# EAGLE design EasyDriver_v45 (EAGLE 6.5.0)
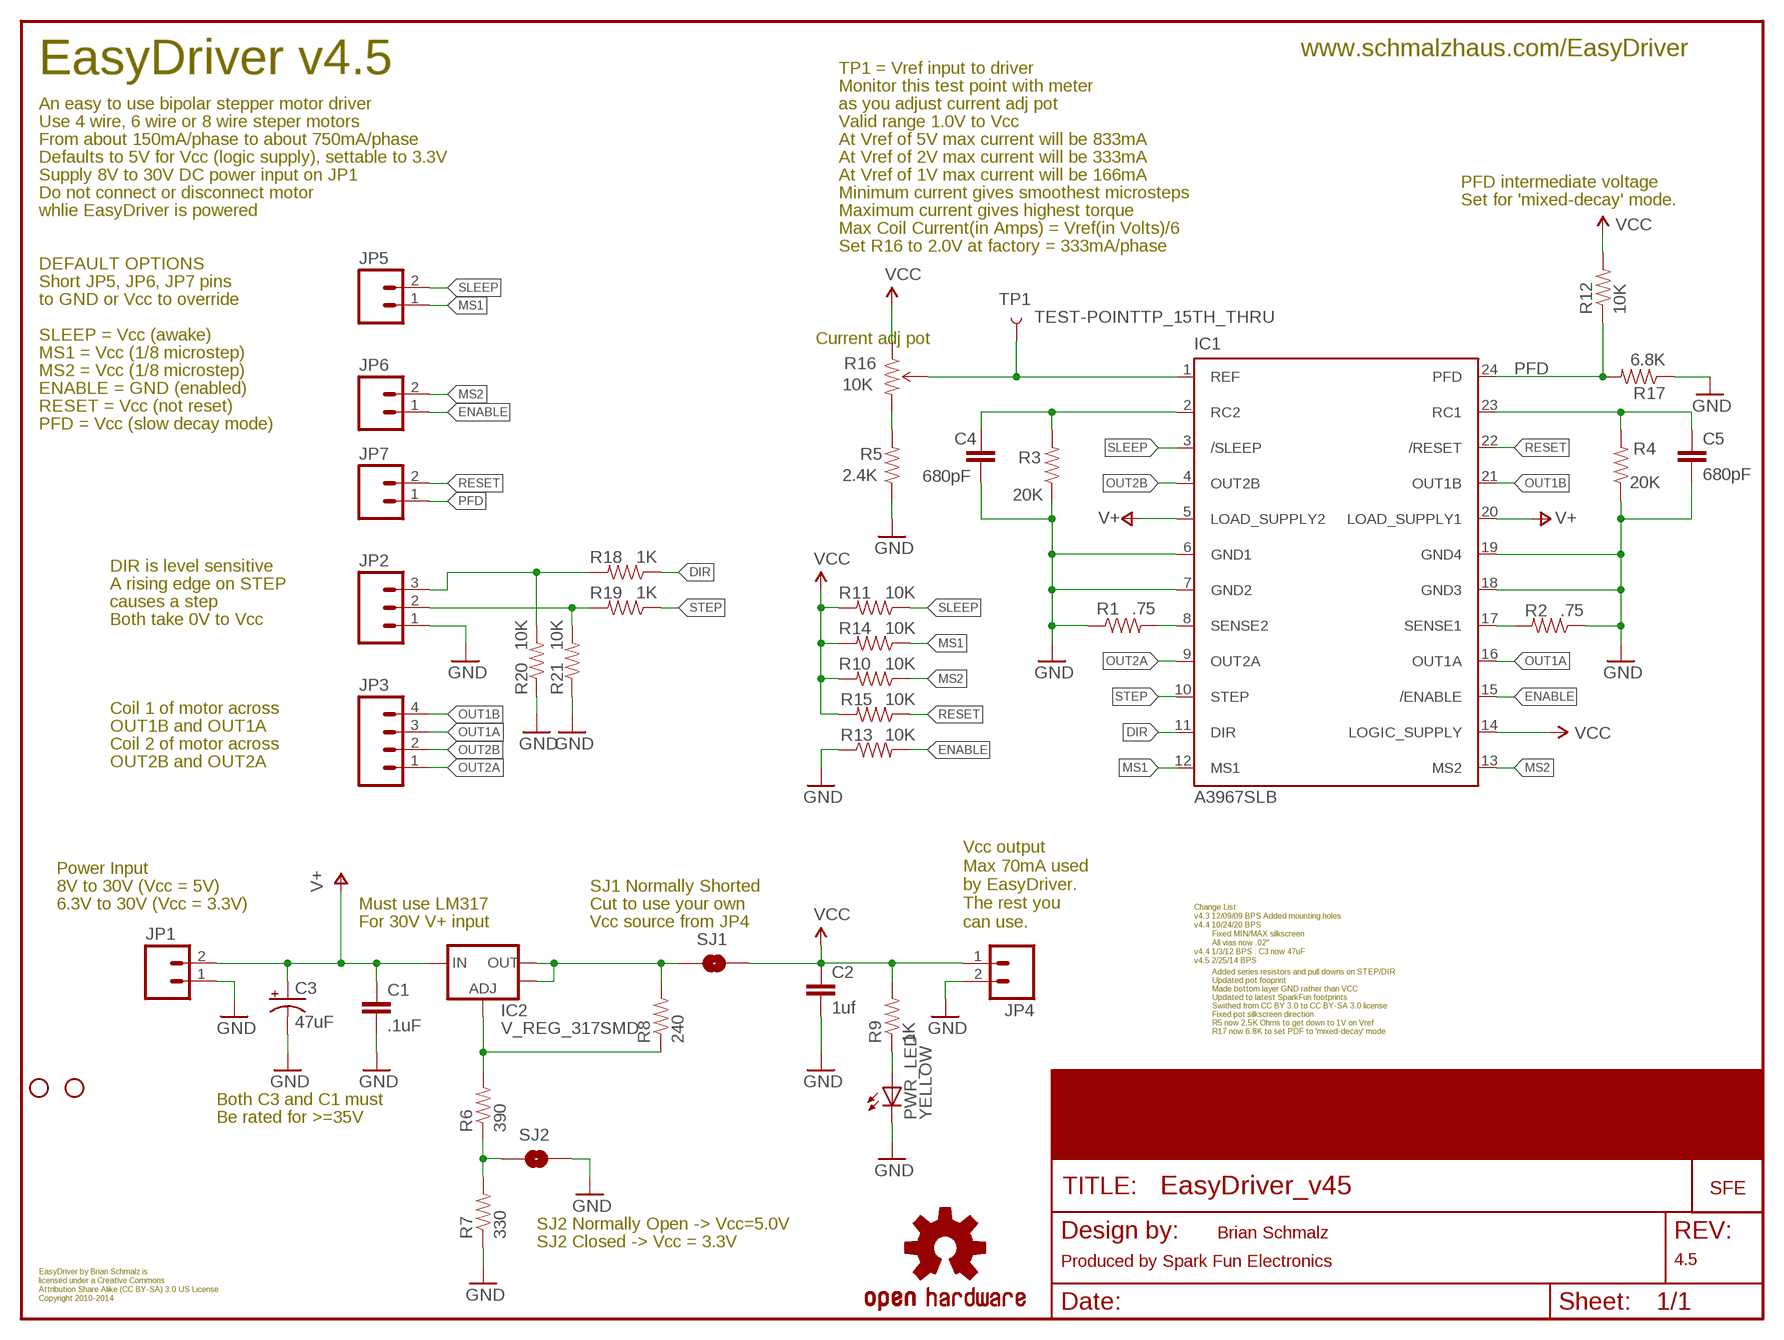
[diagram p0: schematic, sheet 1]

## Parts
C1  .1uF  CAP0603-CAP  [0603-CAP]
C2  1uf  CAP0603-CAP  [0603-CAP]
C3  47uF  CPOL-USD  [PANASONIC_D]
C4  680pF  CAP0603-CAP  [0603-CAP]
C5  680pF  CAP0603-CAP  [0603-CAP]
FRAME2  FRAME-LETTER  [CREATIVE_COMMONS]
IC1  A3967SLB  [SO24W]
IC2  V_REG_317SMD  [SOT223]
JP1  M021X02_NO_SILK  [1X02_NO_SILK]
JP2  M031X03_NO_SILK  [1X03_NO_SILK]
JP3  M041X04_NO_SILK  [1X04_NO_SILK]
JP4  M021X02_NO_SILK  [1X02_NO_SILK]
JP5  M021X02_NO_SILK  [1X02_NO_SILK]
JP6  M021X02_NO_SILK  [1X02_NO_SILK]
JP7  M021X02_NO_SILK  [1X02_NO_SILK]
JP8  STAND-OFF  [STAND-OFF]
JP9  STAND-OFF  [STAND-OFF]
LOGO1  OSHW-LOGOS  [OSHW-LOGO-S]
PWR_LED  YELLOW  LED-YELLOW0603  [LED-0603]
R1  .75  RESISTOR0805-RES  [0805]
R2  .75  RESISTOR0805-RES  [0805]
R3  20K  RESISTOR0603  [0603-RES]
R4  20K  RESISTOR0603  [0603-RES]
R5  2.4K  RESISTOR0603  [0603-RES]
R6  390  RESISTOR0603  [0603-RES]
R7  330  RESISTOR0603  [0603-RES]
R8  240  RESISTOR0603  [0603-RES]
R9  1K  RESISTOR0603  [0603-RES]
R10  10K  RESISTOR0603  [0603-RES]
R11  10K  RESISTOR0603  [0603-RES]
R12  10K  RESISTOR0603  [0603-RES]
R13  10K  RESISTOR0603  [0603-RES]
R14  10K  RESISTOR0603  [0603-RES]
R15  10K  RESISTOR0603  [0603-RES]
R16  10K  TRIMPOT3MM-2  [TRIMPOT-3MM-2]
R17  6.8K  RESISTOR0603  [0603-RES]
R18  1K  RESISTOR0603  [0603-RES]
R19  1K  RESISTOR0603  [0603-RES]
R20  10K  RESISTOR0603  [0603-RES]
R21  10K  RESISTOR0603  [0603-RES]
SJ1  SOLDERJUMPERTRACE  [SJ_2S-TRACE]
SJ2  SOLDERJUMPERNO  [SJ_2S-NO]
TP1  TEST-POINTTP_15TH_THRU  [TP_15TH]
U$2  LOGO-SFENEW  [SFE-NEW-WEBLOGO]

## Nets
5V_ALT: IC2.2(OUT) IC2.4(OUT) R8.2 SJ1.1
DIR: IC1.11(DIR) R18.1
DIR_IN: JP2.3 R18.2 R20.2
ENABLE: IC1.15(/ENABLE) JP6.1 R13.2
GND: C1.2 C2.2 C3.- C4.2 C5.2 IC1.6(GND1) IC1.7(GND2) IC1.18(GND3) IC1.19(GND4) JP1.1 JP2.1 JP4.2 PWR_LED.C R1.1 R2.1 R3.1 R4.1 R5.1 R7.1 R13.1 R17.1 R20.1 R21.1 SJ2.2
MS1: IC1.12(MS1) JP5.1 R14.1
MS2: IC1.13(MS2) JP6.2 R10.1
N$1: IC1.8(SENSE2) R1.2
N$2: PWR_LED.A R9.1
N$3: IC1.17(SENSE1) R2.2
N$4: R6.1 R7.2 SJ2.1
N$5: C4.1 IC1.2(RC2) R3.2
N$6: IC2.1(ADJ) R6.2 R8.1
N$7: C5.1 IC1.23(RC1) R4.2
N$11: R5.2 R16.3(CW)
OUT1A: IC1.16(OUT1A) JP3.3
OUT1B: IC1.21(OUT1B) JP3.4
OUT2A: IC1.9(OUT2A) JP3.1
OUT2B: IC1.4(OUT2B) JP3.2
PFD: IC1.24(PFD) JP7.1 R12.1 R17.2
RESET: IC1.22(/RESET) JP7.2 R15.1
SLEEP: IC1.3(/SLEEP) JP5.2 R11.1
STEP: IC1.10(STEP) R19.1
STEP_IN: JP2.2 R19.2 R21.2
V+: C1.1 C3.+ IC1.5(LOAD_SUPPLY2) IC1.20(LOAD_SUPPLY1) IC2.3(IN) JP1.2
VCC: C2.1 IC1.14(LOGIC_SUPPLY) JP4.1 R9.2 R10.2 R11.2 R12.2 R14.2 R15.2 R16.1(CCW) SJ1.2
VREF: IC1.1(REF) R16.2(WIPER) TP1.P$1

## Notes on the sheet
- www.schmalzhaus.com/EasyDriver
- EasyDriver v4.5 | TP1 = Vref input to driver
- Monitor this test point with meter
- An easy to use bipolar stepper motor driver | as you adjust current adj pot
- Use 4 wire, 6 wire or 8 wire steper motors | Valid range 1.0V to Vcc
- From about 150mA/phase to about 750mA/phase | At Vref of 5V max current will be 833mA
- Defaults to 5V for Vcc (logic supply), settable to 3.3V | At Vref of 2V max current will be 333mA
- Supply 8V to 30V DC power input on JP1 | At Vref of 1V max current will be 166mA
- PFD intermediate voltage
- Do not connect or disconnect motor | Minimum current gives smoothest microsteps
- Set for 'mixed-decay' mode.
- whlie EasyDriver is powered | Maximum current gives highest torque
- Max Coil Current(in Amps) = Vref(in Volts)/6
- Set R16 to 2.0V at factory = 333mA/phase
- DEFAULT OPTIONS
- Short JP5, JP6, JP7 pins
- to GND or Vcc to override
- SLEEP = Vcc (awake) | Current adj pot
- MS1 = Vcc (1/8 microstep)
- MS2 = Vcc (1/8 microstep)
- ENABLE = GND (enabled)
- RESET = Vcc (not reset)
- PFD = Vcc (slow decay mode)
- DIR is level sensitive
- A rising edge on STEP
- causes a step
- Both take 0V to Vcc
- Coil 1 of motor across
- OUT1B and OUT1A
- Coil 2 of motor across
- OUT2B and OUT2A
- Power Input
- 8V to 30V (Vcc = 5V) | SJ1 Normally Shorted
- 6.3V to 30V (Vcc = 3.3V) | Must use LM317 | Cut to use your own | Change List:
- v4.3 12/09/09 BPS Added mounting holes
- For 30V V+ input | Vcc source from JP4
- Vcc output
  Max 70mA used 
  by EasyDriver.
  The rest you 
  can use.
- v4.4 10/24/20 BPS
- Fixed MIN/MAX silkscreen
- All vias now .02"
- v4.4 1/3/12 BPS : C3 now 47uF
- v4.5 2/25/14 BPS
- Added series resistors and pull downs on STEP/DIR
  Updated pot fooprint
  Made bottom layer GND rather than VCC
  Updated to latest SparkFun footprints
  Swithed from CC BY 3.0 to CC BY-SA 3.0 license
  Fixed pot silkscreen direction
  R5 now 2.5K Ohms to get down to 1V on Vref
  R17 now 6.8K to set PDF to 'mixed-decay' mode
- Both C3 and C1 must
- Be rated for >=35V
- SJ2 Normally Open -> Vcc=5.0V
- Brian Schmalz
- SJ2 Closed -> Vcc = 3.3V
- Produced by Spark Fun Electronics | 4.5
- EasyDriver by Brian Schmalz is
- licensed under a Creative Commons
- Attribution Share Alike (CC BY-SA) 3.0 US License
- Copyright 2010-2014

## Library data of the parts
C1 C2 C4 C5 = SparkFun-Capacitors:CAP: Capacitor Standard 0603 ceramic capacitor, and 0.1" leaded capacitor.
C3 = rcl:CPOL-US: POLARIZED CAPACITOR, American symbol
FRAME2 = SparkFun-Aesthetics:FRAME-LETTER: Schematic Frame Standard 8.5x11 US Letter frame
IC1 = Allegro:A3967SLB: ANALOG DEVICES
IC2 = SparkFun03_30_09:V_REG_317: Voltage Regulator Standard LM317 adjustable voltage regulator. AOI (Adjust Output Input). Google 'LM317 Calculator' for easy to use app to get the two resistor values needed. 240/720 for 5V output. 240/390 for 3.3V output. Spark Fun Electronics SKU : COM-00527
JP1 JP4-JP7 = SparkFun:M02: Header 2 Standard 2-pin 0.1" header. Use with straight break away headers (SKU : PRT-00116), right angle break away headers (PRT-00553), swiss pins (PRT-00743), machine pins (PRT-00117), and female headers (PRT-00115). Molex polarized connector foot print use with SKU : PRT-08233 with associated crimp pins and housings.
JP2 = SparkFun:M03: Header 3 Standard 3-pin 0.1" header. Use with straight break away headers (SKU : PRT-00116), right angle break away headers (PRT-00553), swiss pins (PRT-00743), machine pins (PRT-00117), and female headers (PRT-00115). Molex polarized connector foot print use with SKU : PRT-08232 with associated crimp pins and housings.
JP3 = SparkFun:M04: Header 4 Standard 4-pin 0.1" header. Use with straight break away headers (SKU : PRT-00116), right angle break away headers (PRT-00553), swiss pins (PRT-00743), machine pins (PRT-00117), and female headers (PRT-00115). Molex polarized connector foot print use with SKU : PRT-08231 with associated crimp pins and housings.
JP8 JP9 = SparkFun-7-28-09:STAND-OFF: Stand Off This is the mechanical footprint for a #4 phillips button head screw. Use the keepout ring to avoid running the screw head into surrounding components. SKU : PRT-00447
LOGO1 = SparkFun-Aesthetics:OSHW-LOGO: Open Source Hardware Logo This logo indicates the piece of hardware it is found on incorporates a OSHW license and/or adheres to the definition of open source hardware found here: http://freedomdefined.org/OSHW
PWR_LED = SparkFun-LED:LED-YELLOW: Yellow SMD LEDs LilyPad 1206- DIO-09909 0603- DIO-09003; PROD_ID: DIO-09003
R1-R15 R17-R21 = SparkFun-Resistors:RESISTOR: Resistor Basic schematic elements and footprints for 0603, 1206, and PTH resistors.
R16 = SparkFun-Electromechanical:TRIMPOT: Various small potentiometers for "set-and-forget" applications
SJ1 SJ2 = SparkFun03_30_09:SOLDERJUMPER: Solder Jumper Standard SMD solder jumper. Used to automate production. Two varients : Normally Open and Normally Closed are the same, but have different paste layers. NC will have a large amount of paste and should jumper during reflow.
TP1 = SparkFun-Passives:TEST-POINT: Bare copper test points for troubleshooting or ICT
U$2 = SparkFun:LOGO-SFE: Spark Fun Electronics PCB Logo This is the standard Spark Fun Electronics PCB logo.

## Board
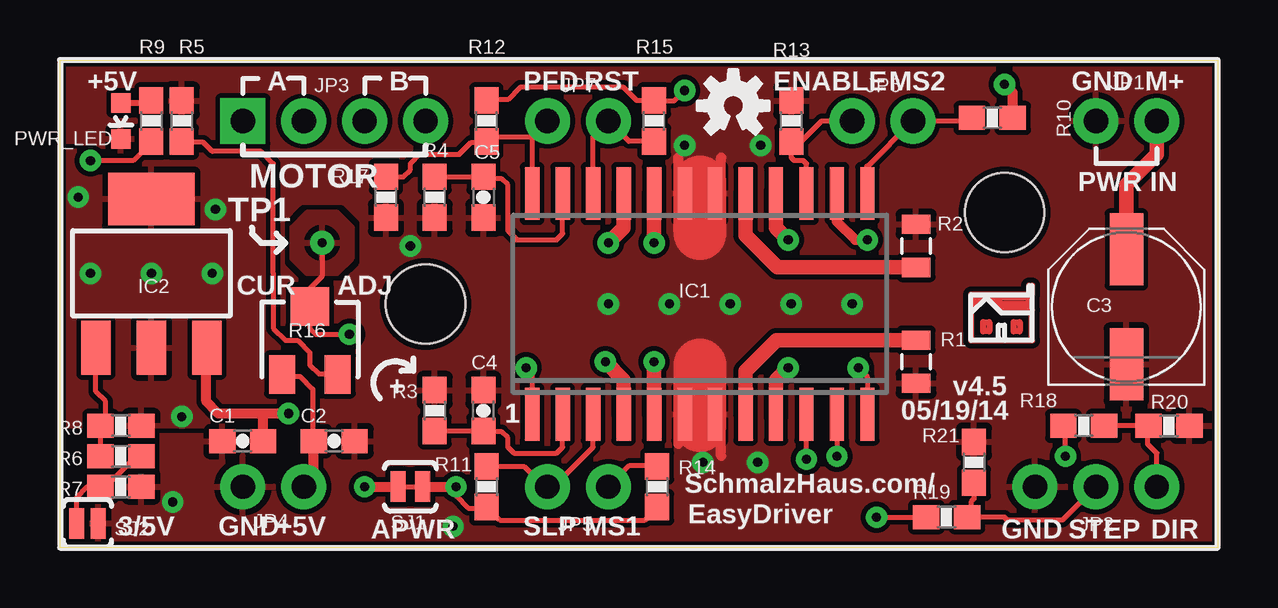
[diagram p1: board, top side]
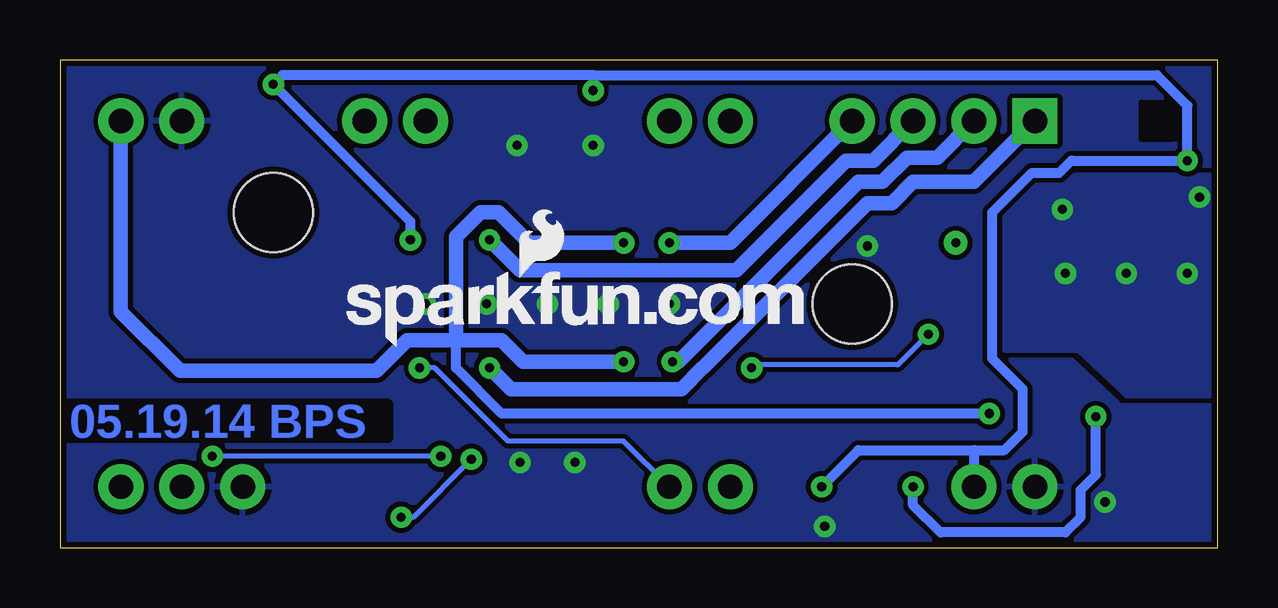
[diagram p2: board, bottom side, seen from below]

Size 48.26 x 20.32 mm. Coordinates in mm from the lower left corner, seen from the top.
Outline: 0,0 0,20.32 48.26,20.32 48.26,0 0,0
Copper layers (1*16): Top 0.035mm / dielectric 1.5mm / Bottom 0.035mm
Design rules "GoldPhoenix_8and8": minimum track width 7mil, minimum drill 15mil, track to track 8mil, track to pad 8mil, pad to pad 8mil, via to via 8mil, smd to smd 8mil, copper to edge 10mil, drill to drill 8mil, minimum pad ring 12mil, minimum via ring 10mil, stop-mask expansion 4mil, vias tented up to drill 25mil, thermal gap 10mil
bRestrict: area 1.9,17 to 3.2,18.5

### Footprints (pad centres in the part's own frame; a part is rotated, then mirrored left to right if it is on the bottom)
0603-CAP = smd 1.1 x 1: 1 -0.85,0; 2 0.85,0
PANASONIC_D = smd 3 x 1.4: + 2.4,0; - -2.4,0
SO24W = smd 0.6 x 2.2: 1 -6.985,-4.6; 2 -5.715,-4.6; 3 -4.445,-4.6; 4 -3.175,-4.6; 5 -1.905,-4.6; 6 -0.635,-4.6; 7 0.635,-4.6; 8 1.905,-4.6; 9 3.175,-4.6; 10 4.445,-4.6; 11 5.715,-4.6; 12 6.985,-4.6; 13 6.985,4.6; 14 5.715,4.6; 15 4.445,4.6; 16 3.175,4.6; 17 1.905,4.6; 18 0.635,4.6; 19 -0.635,4.6; 20 -1.905,4.6; 21 -3.175,4.6; 22 -4.445,4.6; 23 -5.715,4.6; 24 -6.985,4.6
SOT223 = smd 1.219 x 2.235: 1 -2.311,-3.099; 2 0,-3.099; 3 2.311,-3.099 | smd 3.6 x 2.2: 4 0,3.099
1X02_NO_SILK = drill 1.016 pad 1.88: 1 0,0; 2 2.54,0
1X03_NO_SILK = drill 1.016 pad 1.88: 1 0,0; 2 2.54,0; 3 5.08,0
1X04_NO_SILK = drill 1.016 pad 1.88 square: 1 0,0 | drill 1.016 pad 1.88: 2 2.54,0; 3 5.08,0; 4 7.62,0
STAND-OFF = hole 3.302: 0,0
LED-0603 = smd 0.8 x 0.8: A 0,-0.75; C 0,0.75
0805 = smd 0.8 x 1.2: 1 -0.9,0; 2 0.9,0
0603-RES = smd 1.1 x 1: 1 -0.85,0; 2 0.85,0
TRIMPOT-3MM-2 = smd 1.092 x 1.6: 1 -1.155,-1.421; 3 1.155,-1.421 | smd 1.6 x 1.6: 2 0,1.421
SJ_2S-TRACE = smd 0.635 x 1.27: 1 -0.508,0; 2 0.508,0
SJ_2S-NO = smd 0.635 x 1.27: 1 -0.45,0; 2 0.45,0
TP_15TH = drill 0.381 pad 0.61: P$1 0,0

### Placement (x,y rotation side)
C1  7.62,4.45 180 top
C2  11.43,4.45 0 top
C3  44.45,10.03 90 top
C4  17.65,5.71 90 top
C5  17.65,14.61 270 top
FRAME2  17.78,-10.16 0 top  (outside the outline)
IC1  26.67,10.16 0 top
IC2  3.81,11.43 0 top
JP1  43.18,17.78 0 top
JP2  40.64,2.54 0 top
JP3  7.62,17.78 0 top
JP4  10.16,2.54 180 top
JP5  22.86,2.54 180 top
JP6  33.02,17.78 0 top
JP7  20.32,17.78 0 top
JP8  39.37,13.97 0 top
JP9  15.24,10.16 0 top
LOGO1  28.07,18.41 0 top
PWR_LED  2.54,17.78 180 top
R1  35.69,7.75 90 top
R2  35.69,12.57 270 top
R3  15.62,5.71 270 top
R4  15.62,14.61 90 top
R5  5.08,17.78 270 top
R6  2.54,3.81 180 top
R7  2.54,2.54 180 top
R8  2.54,5.08 0 top
R9  3.81,17.78 270 top
R10  38.86,17.91 0 top
R11  17.78,2.54 270 top
R12  17.78,17.78 90 top
R13  30.48,17.78 270 top
R14  24.89,2.54 270 top
R15  24.77,17.78 90 top
R16  10.41,8.64 0 top
R17  13.59,14.61 90 top
R18  42.67,5.08 0 top
R19  36.96,1.27 0 top
R20  46.23,5.08 180 top
R21  38.1,3.56 270 top
SJ1  14.61,2.54 0 top
SJ2  1.14,1.02 0 top
TP1  10.92,12.7 0 top
U$1  [SCHMALZHAUS_SMALL]  39.24,8.64 0 top
U$2  36.32,8.38 0 bottom

### Tracks (layer width: path | path; a pad name or v marks a point on that pad's centre or on a via)
5V_ALT  (via drill 0.38)
  Top 0.254: R8.2 3.81,5.08
  Top 0.406: v12.7,2.54 SJ1.1
  Bottom 0.406: v5.08,5.46 5.08,3.05 5.71,2.41 5.71,1.27 6.35,0.64 11.56,0.64 12.7,1.78 v12.7,2.54
  other vias: 1.27,11.43 3.81,11.43 6.35,11.43 6.48,14.1 0.76,14.61
  pour Top (rank 2): 0,5.08 0,16.51 10.16,16.51 10.16,5.08
  pour Bottom (rank 2): 0,15.49 7.49,15.49 8.89,13.97 8.89,8.26 5.84,8.26 3.81,6.35 0,6.35
DIR  (via drill 0.38)
  Top 0.203: IC1.11 v32.38,3.81 | v41.91,3.81 41.91,4.99 R18.1
  Bottom 0.203: v32.38,3.81 v41.91,3.81
DIR_IN
  Top 0.203: JP2.3 45.72,3.94 45.34,4.32 45.34,5.04 R20.2 R18.2
ENABLE
  Top 0.203: IC1.15 31.11,16 30.99,16.13 30.61,16.13 30.48,16.26 R13.2 30.9,16.93 31.75,17.78 JP6.1
GND  (via drill 0.38)
  Top 0.203: 25.78,6.99 26.29,6.99 26.67,7.37
  Top 0.406: 27.56,3.81 27.56,7.24 | 27.56,13.21 27.56,16.26 | 25.78,13.21 25.78,16.26 | 25.78,4.32 25.78,6.99
  Top 2.184: 26.67,13.08 26.67,15.24 | 26.67,5.08 26.67,7.37 26.67,7.62
  other vias: 25.4,10.16 27.94,10.16 22.86,10.16 30.48,10.16 33.02,10.16 4.7,1.91 14.61,12.57 16.38,0.89 26.8,3.56 29.08,3.56 26.04,16.76 29.21,16.76
  pour Top (rank 3): 0,0 0,5.08 0,20.32 48.26,20.32 48.26,0
  pour Bottom (rank 3): 15.24,17.78 17.65,15.24 17.78,15.37 17.65,15.37
  pour Bottom (rank 4): 0,0 0,20.32 48.26,20.32 48.26,0
MS1  (via drill 0.38)
  Top 0.203: IC1.12 33.66,7.11 v33.27,7.49 | 23.51,3.19 JP5.1 23.75,3.43 24.85,3.43 R14.1
  Bottom 0.203: v33.27,7.49 32.64,7.49 29.59,4.45 24.77,4.45 JP5.1
MS2
  Top 0.203: 33.66,15.88 JP6.2 37.88,17.78 R10.1
  Top 0.254: IC1.13 33.66,15.88
N$1
  Top 0.406: 35.31,8.64 35.69,8.64 R1.2
  Top 0.61: IC1.8 28.57,7.34 29.87,8.64 35.31,8.64
N$2
  Top 0.254: PWR_LED.A 3.81,18.53 R9.1
N$3
  Top 0.406: 35.31,11.68 35.69,11.68 R2.2
  Top 0.61: IC1.17 28.57,13.02 29.91,11.68 35.31,11.68
N$4
  Top 0.203: SJ2.1 0.69,2.09 1.14,2.54 R7.2 1.91,2.54 2.92,3.56 3.14,3.56 R6.1
N$5
  Top 0.203: R3.2 C4.1 17.69,4.83 18.41,4.83 18.67,4.57 18.67,4.19 18.92,3.94 20.7,3.94 20.95,4.19 IC1.2
N$6
  Top 0.203: R6.2 R8.1 | 1.91,5.08 1.91,6.1 1.5,6.5 IC2.1
  Top 0.406: 1.27,8.1 1.5,8.1 IC2.1 | R8.1 1.91,5.08
N$7
  Top 0.203: IC1.23 20.95,13.08 20.7,12.83 19.05,12.83 18.67,13.21 18.67,15.11 18.41,15.37 17.74,15.37 C5.1 R4.2
N$11
  Top 0.203: R5.2 5.12,16.89 5.97,16.89 6.35,16.51 8.38,16.51 8.89,16 8.89,11.43 8.89,9.14 9.4,8.64 9.91,8.64 10.41,8.13 10.41,7.62 10.79,7.24 11.54,7.24 R16.3
OUT1A  (via drill 0.38)
  Top 0.406: IC1.16 29.94,14.76
  Top 0.61: 29.84,14.86 IC1.16 29.84,13.34 v30.35,12.83
  Bottom 0.61: v30.35,12.83 29.08,11.56 20.07,11.56 15.49,16.13 14.35,16.13 JP3.3
OUT1B  (via drill 0.38)
  Top 0.61: v22.86,12.7 23.5,13.34 IC1.21
  Bottom 0.61: v22.86,12.7 20.32,12.7 JP3.4
OUT2A  (via drill 0.38)
  Top 0.406: IC1.9 29.75,5.56
  Top 0.61: 29.84,5.46 IC1.9 29.84,6.99 v30.35,7.49
  Bottom 0.406: 21.46,7.49 21.47,7.49
  Bottom 0.61: 21.46,7.49 14.61,14.35 13.59,14.35 12.7,15.24 10.16,15.24 JP3.1 | v30.35,7.49 29.46,6.6 22.36,6.6 21.47,7.49
OUT2B  (via drill 0.38)
  Top 0.61: v22.73,7.75 23.5,6.99 IC1.4
  Bottom 0.61: JP3.2 11.68,16.26 12.95,16.26 13.97,15.24 14.99,15.24 22.48,7.75 v22.73,7.75
PFD
  Top 0.203: 19.68,17.14 IC1.24 | 17.8,17.13 19.67,17.13 JP7.1 | 17.8,17.13 17.8,16.95 R12.1 17.74,16.89 17.14,16.89 16.64,16.38 14.99,16.38 14.61,16 14.61,15.75 14.31,15.46 R17.2 | 17.8,17.13 17.78,17.13 17.77,17.14
  Top 0.254: IC1.24 19.68,14.73 | 19.67,17.13 19.68,17.14
RESET
  Top 0.203: IC1.22 22.23,17.14 JP7.2 23.71,16.93 R15.1
SLEEP
  Top 0.203: IC1.3 22.23,4.19 20.57,2.54 JP5.2 20.19,2.54 19.34,3.39 R11.1
  Top 0.305: IC1.3 22.23,5.59
STEP  (via drill 0.38)
  Top 0.203: v31.11,3.68 IC1.10 | v34.04,1.27 R19.1
  Bottom 0.203: v34.04,1.27 33.53,1.27 v31.11,3.68
STEP_IN
  Top 0.203: JP2.2 41.78,1.14 39.5,1.14 39.37,1.27 R19.2 37.97,1.44 37.97,1.91 38.1,2.03 R21.2
V+  (via drill 0.38)
  Top 0.203: 8.47,5.55 8.51,5.59
  Top 0.406: IC2.3 6.12,8.31 6.1,8.31 6.1,6.1 6.6,5.59 8.51,5.59 v9.53,5.59 | C1.1 8.47,5.55
  Top 0.61: v24.77,12.7 IC1.20 | v24.77,7.75 IC1.5 | C3.+ 44.45,15.11 45.72,16.38 JP1.2
  Bottom 0.406: 31.75,8.64 31.75,7.49 29.84,5.59 v9.53,5.59
  Bottom 0.61: v24.77,7.75 28.96,7.75 29.84,8.64 31.75,8.64 | 31.75,8.64 33.78,8.64 35.05,7.37 43.25,7.37 45.72,9.83 JP1.2 | v24.77,12.7 28.7,12.7 29.97,13.97 30.73,13.97 31.75,12.95 31.75,8.64
VCC  (via drill 0.38)
  Top 0.203: 24.93,1.69 24.38,1.14 18.33,1.14 R11.2 17.74,1.65 17.02,1.65 16.51,2.16 v16.51,2.54 | R9.2 3.81,16.89 3.05,16.13 v1.27,16.13 | C2.1 10.54,4.48 10.54,6.6 10.03,7.11 9.36,7.11 R16.1 | v26.04,19.05 25.61,18.63 R15.2 24.04,18.63 23.5,19.18 19.18,19.18 18.67,18.67 17.82,18.67 R12.2
  Top 0.254: 24.93,1.69 R14.2
  Top 0.406: IC1.14 32.38,13.59 33.15,12.83 v33.66,12.83 | SJ1.2 v16.51,2.54 | C2.1 10.58,2.96 JP4.1 | R10.2 39.71,18.96 v39.37,19.3
  Bottom 0.203: v33.66,12.83 33.66,12.95 | JP4.1 | v26.04,19.05 26.04,19.68
  Bottom 0.406: 33.66,12.95 33.66,13.59 v39.37,19.3 38.99,19.68 38.35,19.68 26.04,19.68 2.54,19.68 1.27,18.41 v1.27,16.13 6.1,16.13 6.6,15.62 7.75,15.62 9.4,13.97 9.4,7.87 8.13,6.6 8.13,4.83 8.89,4.06 10.16,4.06 | v16.51,2.54 14.99,4.06 10.16,4.06 | 10.16,4.06 JP4.1
VREF  (via drill 0.38)
  Top 0.203: IC1.1 19.68,7.24 v19.43,7.49 | v12.06,8.89 10.67,8.89 10.41,9.14 R16.2 10.41,10.79 10.92,11.3 TP1.P$1
  Bottom 0.203: 19.3,7.62 13.34,7.62 v12.06,8.89
  Bottom 0.254: 19.3,7.62 v19.43,7.49
  pour Top: 11.56,13.97 10.29,13.97 9.65,13.34 9.65,12.06 10.29,11.43 11.56,11.43 12.19,12.06 12.19,13.34

### Text on the board
Bottom: 05.19.14 BPS
tPlace: +5V | A | B | PFD | RST | ENABLE | MS2 | GND | M+ | MOTOR | PWR IN | TP1 | CUR | ADJ | + | v4.5 | 1 | 05/19/14 | SchmalzHaus.com/ | 3/5V | GND | +5V | SLP | MS1 | EasyDriver | APWR | GND | STEP | DIR